# EAGLE design mp28164-buck-boost-flashlight-driver-tester-mk-1.1.0 (EAGLE 9.2.2)
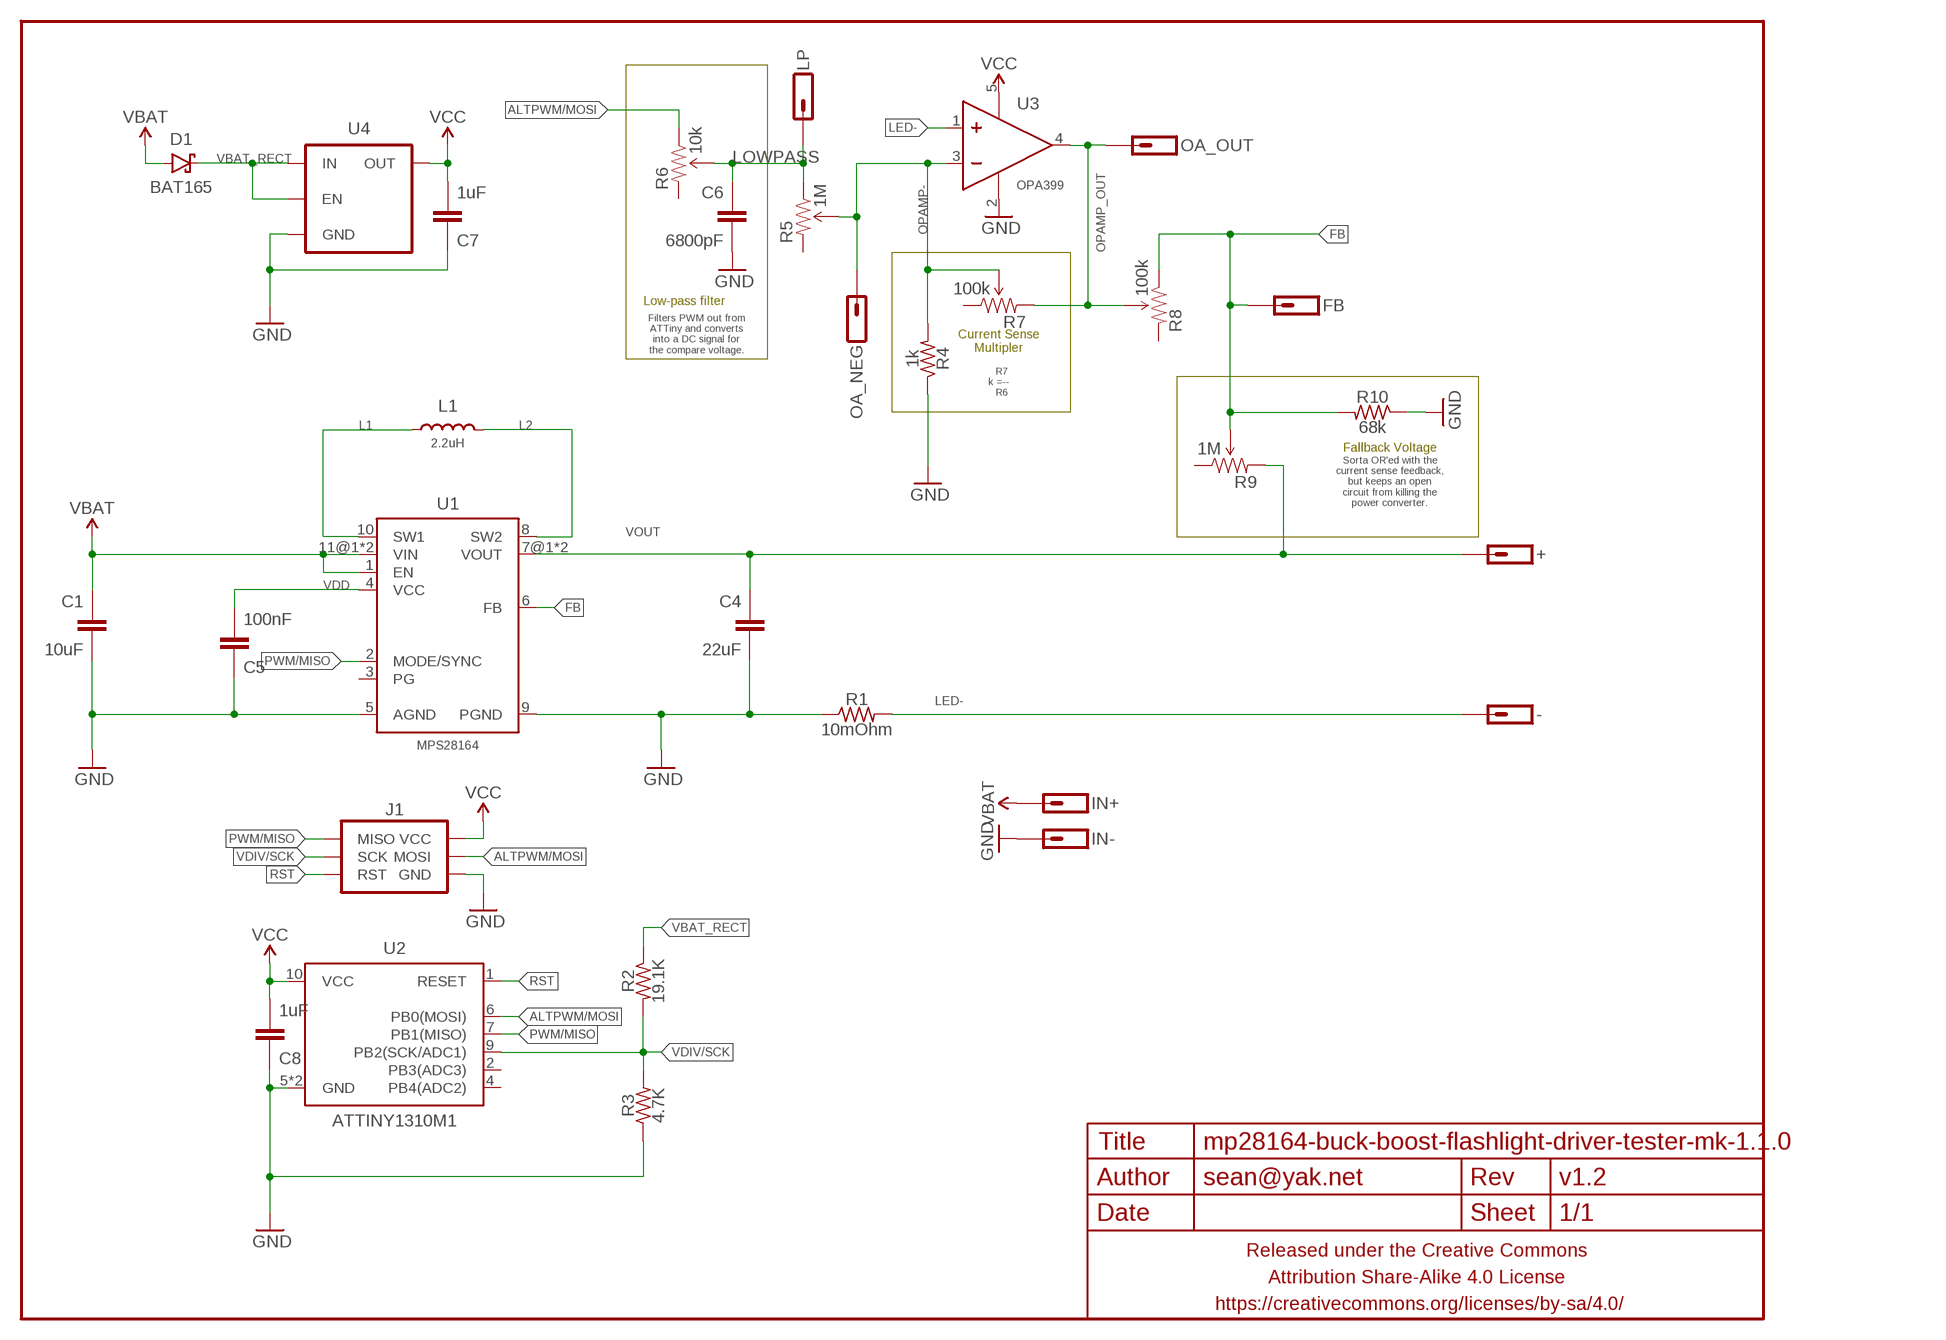
[diagram p0: schematic, sheet 1]

## Parts
+  M01PTH-1MM-CIR-NS  [1X01-1MM-CIR-NS]
-  M01PTH-1MM-CIR-NS  [1X01-1MM-CIR-NS]
C1  10uF  CAPACITOR-CERAMICC1206  [C1206]
C4  22uF  CAPACITOR-CERAMICC1206  [C1206]
C5  100nF  CAPACITOR-CERAMICC0402  [C0402]
C6  6800pF  CAPACITOR-CERAMICC0402  [C0402]
C7  1uF  CAPACITOR-CERAMICC0402  [C0402]
C8  1uF  CAPACITOR-CERAMICC0402  [C0402]
D1  BAT165  DIODE-SCHOTTKYSOD323  [SOD323-SCHOTTKY]
FB  M01SMD-1MM-DIA-NS  [1X01-SMD-1MM-DIA-NS]
FRAME1  FRAME-LETTERNO_PACKAGE  [DUMMY]
IN+  M01PTH-1MM-CIR-NS  [1X01-1MM-CIR-NS]
IN-  M01PTH-1MM-CIR-NS  [1X01-1MM-CIR-NS]
J1  AVR_SPI_PRG_6PTH  [2X3]
L1  2.2uH  INDUCTORXAL7070  [XAL7070]
LP  M01SMD-1MM-DIA-NS  [1X01-SMD-1MM-DIA-NS]
OA_NEG  M01SMD-1MM-DIA-NS  [1X01-SMD-1MM-DIA-NS]
OA_OUT  M01SMD-1MM-DIA-NS  [1X01-SMD-1MM-DIA-NS]
R1  10mOhm  RESISTORR1206  [R1206]
R2  19.1K  RESISTORR0402  [R0402]
R3  4.7K  RESISTORR0402  [R0402]
R4  1k  RESISTORR0402  [R0402]
R5  1M  TRIMPOTEVM3Y-LESS  [EVM3Y-LESS]
R6  10k  TRIMPOTEVM3Y-LESS  [EVM3Y-LESS]
R7  100k  TRIMPOTEVM3Y-LESS  [EVM3Y-LESS]
R8  100k  TRIMPOTEVM3Y-LESS  [EVM3Y-LESS]
R9  1M  TRIMPOTEVM3Y-LESS  [EVM3Y-LESS]
R10  68k  RESISTORR0402  [R0402]
U1  MPS28164  [MPS28164]
U2  ATTINY1310M1  [QFN10(2X5)]
U3  OPA399  OPAMPOPA333-SC-70  [SC70]
U4  V_REG_ENTLV700  [SC70]

## Nets
ALTPWM/MOSI: J1.4(MOSI) R6.A(CCW) U2.6(PB0(MOSI))
FB: FB.P$1 R8.A(CCW) R9.S(WIPER) R10.2 U1.6(FB)
GND: C1.2 C4.2 C5.1 C6.2 C7.1 C8.1 IN-.1 J1.6(GND) R1.1 R3.1 R4.1 R10.1 U1.5(AGND) U1.9(PGND) U2.5(GND) U2.PAD(GND) U3.2(V-) U4.2(GND)
L1: L1.P$1 U1.10(SW1)
L2: L1.P$2 U1.8(SW2)
LED-: -.1 R1.2 U3.1(IN+)
LOWPASS: C6.1 LP.P$1 R5.A(CCW) R6.S(WIPER)
OPAMP-: OA_NEG.P$1 R4.2 R5.S(WIPER) R7.S(WIPER) U3.3(IN-)
OPAMP_OUT: OA_OUT.P$1 R7.E(CW) R8.S(WIPER) U3.4(OUT)
PWM/MISO: J1.1(MISO) U1.2(MODE/SYNC) U2.7(PB1(MISO))
RST: J1.5(RST) U2.1(RESET)
VBAT: C1.1 D1.A IN+.1 U1.1(EN) U1.11@1(VIN) U1.11@2(VIN)
VBAT_RECT: D1.C R2.1 U4.1(IN) U4.3(EN)
VCC: C7.2 C8.2 J1.2(VCC) U2.10(VCC) U3.5(V+) U4.5(OUT)
VDD: C5.2 U1.4(VCC)
VDIV/SCK: J1.3(SCK) R2.2 R3.2 U2.9(PB2(SCK/ADC1))
VOUT: +.1 C4.1 R9.E(CW) U1.7@1(VOUT) U1.7@2(VOUT)
Unconnected: R5.E(CW) R6.E(CW) R7.A(CCW) R8.E(CW) R9.A(CCW) U1.3(PG) U2.2(PB3(ADC3)) U2.4(PB4(ADC2))

## Notes on the sheet
- Low-pass filter
- Filters PWM out from
  ATTiny and converts
  into a DC signal for
  the compare voltage.
- Current Sense
  Multipler
- R7
  k =--
    R6
- Fallback Voltage
- Sorta OR'ed with the
  current sense feedback,
  but keeps an open
  circuit from killing the
  power converter.

## Library data of the parts
+ - FB IN+ IN- LP OA_NEG OA_OUT = a_parts:M01: Header 1 Standard 1-pin 0.1" header. Use with straight break away headers (SKU : PRT-00116), right angle break away headers (PRT-00553), swiss pins (PRT-00743), machine pins (PRT-00117), and female headers (PRT-00115).
C1 C4-C8 = a_parts:CAPACITOR-CERAMIC: CAPACITOR, European symbol
D1 = a_parts:DIODE-SCHOTTKY: Schottky diodes in SFE's production catalog BAT20J 1A 23V 0.62Vf RB751 120mA 40V 0.37Vf PMEG4005EJ 0.5A 40V 0.42Vf MBRA140 1A 40V 0.5Vf B340A 3A 40V SMA
FRAME1 = a_parts:FRAME-LETTER: Schematic Frame Standard 8.5x11 US Letter frame; DESIGNER: sean@yak.net; VERSION: v1.2
J1 = a_parts:AVR_SPI_PRG_6: AVR ISP 6 Pin This is the reduced ISP connector for AVR programming. Common on Arduino. This footprint will take up less PCB space and can be used with a 10-pin to 6-pin adapter such as SKU: BOB-08508 **Special note about "TEST_POINT" package. The stop mask is on the top side, so if you want your programming test points to be on the bottom of your board, make sure to place this package on the bottom side of the board. This also ensure that the orientation to program from the bottom side will be correct.
L1 = a_parts:INDUCTOR: Inductors Basic Inductor/Choke - 0603 and 1206. Footprints are not proven and vary greatly between part numbers. SRN6045- 33uH, 20% 1.4A SDR0403-560KL - 56uH, 10%, 500mA RMS/740mA peak
R1-R4 R10 = a_parts:RESISTOR: RESISTOR, American symbol
R5-R9 = a_parts:TRIMPOT: Various small potentiometers for "set-and-forget" applications
U1 = a_parts:MPS28164
U2 = a_parts:ATTINY13: Atmel 8-pin 1kB flash uC
U3 = a_parts:OPAMP
U4 = a_parts:V_REG_EN

## Board
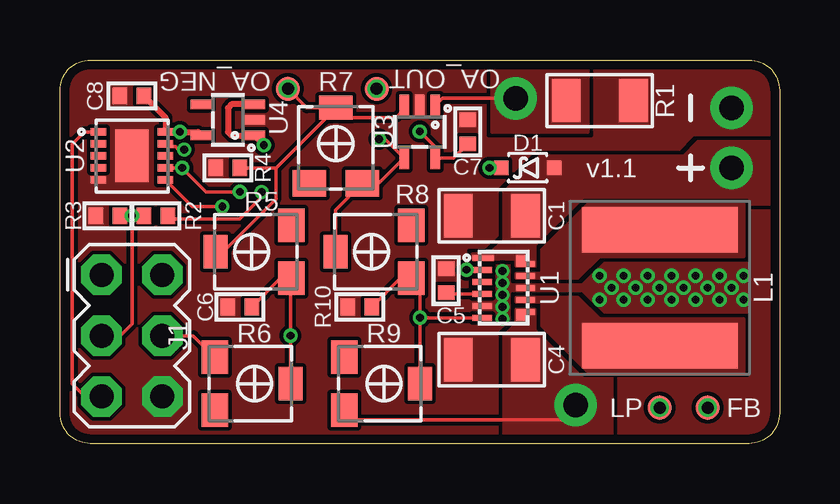
[diagram p1: board, top side]
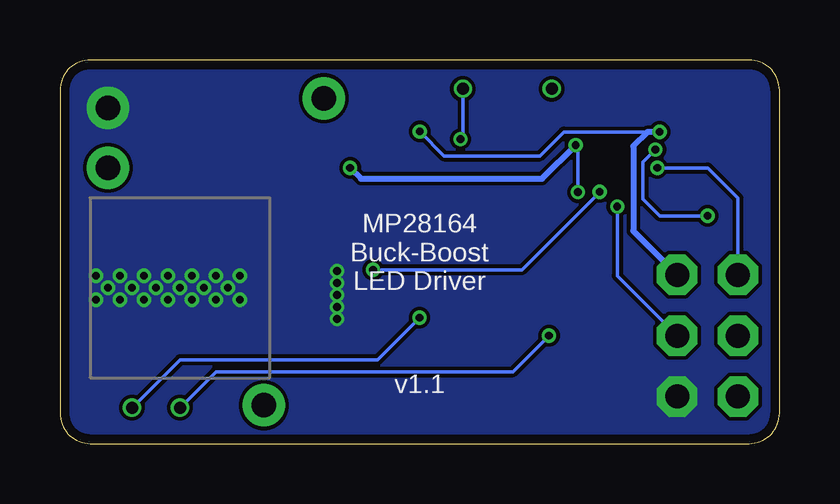
[diagram p2: board, bottom side, seen from below]

Size 30 x 16 mm. Coordinates in mm from the lower left corner, seen from the top.
Outline: 1.27,16 28.73,16 arc-90 30,14.73 30,1.27 arc-90 28.73,0 1.27,0 arc-90 0,1.27 0,14.73 arc-90 1.27,16
Copper layers (1*16): Top 0.035559375mm / dielectric 1.6mm / Bottom 0.035559375mm
Design rules "oshpark-2layer *": minimum track width 6mil, minimum drill 10mil, track to track 6mil, track to pad 6mil, pad to pad 6mil, via to via 6mil, smd to smd 0mil, copper to edge 15mil, drill to drill 6mil, minimum pad ring 5mil, minimum via ring 5mil, stop-mask expansion 2.5mil, vias tented up to drill 0.499mm, thermal gap 10mil

### Footprints (pad centres in the part's own frame; a part is rotated, then mirrored left to right if it is on the bottom)
1X01-1MM-CIR-NS = drill 1.016 pad 1.778: 1 0,0
C1206 = smd 1.2 x 1.8: 1 -1.4,0; 2 1.4,0
C0402 = smd 0.6 x 0.7: 1 -0.5,0; 2 0.5,0
SOD323-SCHOTTKY = smd 0.6 x 0.6: A -1.1,0; C 1.1,0
1X01-SMD-1MM-DIA-NS = smd 1 x 1: P$1 0,0
2X3 = drill 1 pad 1.676 octagon: 1 -2.54,-1.27; 2 -2.54,1.27; 3 0,-1.27; 4 0,1.27; 5 2.54,-1.27; 6 2.54,1.27
XAL7070 = smd 1.9 x 6.5: P$1 -2.41,0; P$2 2.41,0
R1206 = smd 1.2 x 1.8: 1 -1.4,0; 2 1.4,0
R0402 = smd 0.6 x 0.7: 1 -0.5,0; 2 0.5,0
EVM3Y-LESS = smd 1.4 x 1.1: A -1.1,-1.65; E 1.1,-1.65 | smd 1.4 x 1: S 0,1.5
MPS28164 = smd 0.9 x 0.25: 1 -0.85,1.25 | smd 0.8 x 0.25: 2 -0.9,0.75; 3 -0.9,0.25; 4 -0.9,-0.25; 5 -0.9,-0.75; 6 -0.9,-1.25; 7@1 0.9,-1; 8 0.9,-0.5; 9 0.9,0; 10 0.9,0.5; 11@1 0.9,1 | smd 0.4 x 0.25: 7@2 0.7,-1.25; 11@2 0.71,1.25
QFN10(2X5) = smd 0.65 x 0.3: 1 -1.4,1; 2 -1.4,0.5; 3 -1.4,0; 4 -1.4,-0.5; 5 -1.4,-1; 6 1.4,-1; 7 1.4,-0.5; 8 1.4,0; 9 1.4,0.5; 10 1.4,1 | smd 1.4 x 2.2: PAD 0,0
SC70 = smd 0.4 x 0.9: 1 -0.65,-1.1; 2 0,-1.1; 3 0.65,-1.1; 4 0.65,1.1; 5 -0.65,1.1

### Placement (x,y rotation side)
+  21.5,1.6 270 top
-  19,14.4 180 top
C1  18,9.5 180 top
C4  18,3.5 180 top
C5  16.1,6.8 270 top
C6  7.5,5.7 180 top
C7  17,13 270 top
C8  3,14.5 0 top
D1  19.5,11.5 180 top
FB  27,1.5 0 top
FRAME1  0,0 270 top
IN+  28,11.5 0 top
IN-  28,14 270 top
J1  3,4.5 270 top
L1  25,6.5 270 top
LP  25,1.5 0 top
OA_NEG  9.5,14.8 0 top
OA_OUT  13.2,14.8 0 top
R1  22.5,14.3 180 top
R2  4,9.5 180 top
R3  2,9.5 0 top
R4  7,11.5 0 top
R5  7.99,8 90 top
R6  8.11,2.5 270 top
R7  11.5,12.51 0 top
R8  12.99,8 90 top
R9  13.51,2.5 270 top
R10  12.5,5.7 0 top
U1  18.5,6.5 0 top
U2  3,12 0 top
U3  15,13 180 top
U4  7,13.5 90 top

### Tracks (layer width: path | path; a pad name or v marks a point on that pad's centre or on a via)
ALTPWM/MOSI  (via drill 0.33)
  Top 0.152: U2.6 5.51,9.89 v6.77,9.89 | J1.4 5.56,4.5 R6.A
  Bottom 0.152: v6.77,9.89 6.77,7 J1.4
FB  (via drill 0.33, 0.5)
  Top 0.152: U1.6 v15.01,5.25 | R10.2 14.2,6.9 R8.A 15.01,6.53 v15.01,5.25 | R9.S v15.01,5.25
  Bottom 0.152: v15.01,5.25 16.76,3.5 25,3.5 FB.P$1
  other vias: 27,1.5
GND  (via drill 0.33)
  other vias: 23,6.5 24,6.5 25,6.5 26,6.5 27,6.5 28,6.5 28.5,7 28.5,6 27.5,6 27.5,7 26.5,7 25.5,7 24.5,7 23.5,7 22.5,7 22.5,6 23.5,6 24.5,6 25.5,6 26.5,6 18.45,7.2 18.45,6.7 18.45,6.2 18.45,5.7 18.45,5.2
  pour Top (rank 6, no thermals): 0,16 0,0 30,0 30,16
  pour Bottom (rank 6, no thermals): 0,0 0,16 30,16 30,0
L1
  pour Top (rank 2, no thermals): 19,7.1 19,6.9 21.6,6.9 22.5,7.8 28.5,7.8 28.5,10 22,10 20.1,8.1 20.1,7.1
L2
  pour Top (rank 2, no thermals): 19,6.1 19,5.9 20.1,5.9 20.1,4.9 22,3 28.5,3 28.5,5.2 22.5,5.2 21.6,6.1
LED-
  Top 0.152: U3.1 15.95,14.4 -.1
  pour Top (rank 2, no thermals): 18,16 18,13 22,13 22,16
LOWPASS  (via drill 0.33, 0.5)
  Top 0.152: C6.1 9.2,6.9 R5.A 9.61,6.87 v9.61,4.5 R6.S
  Bottom 0.152: LP.P$1 23.5,3 11.11,3 v9.61,4.5
  other vias: 25,1.5
OPAMP-  (via drill 0.5)
  Top 0.152: R5.S 6.8,8 9,10.2 9,11.5 | 9,11.5 R4.2 | R7.S 10.29,14.01 OA_NEG.P$1 | R7.S 9,11.5 | U3.3 14.35,13.95 14,13.6 11.9,13.6 R7.S
  other vias: 9.5,14.8
OPAMP_OUT  (via drill 0.33, 0.5)
  Top 0.152: R8.S 11.49,9.75 R7.E 13.31,10.86 U3.4 13.55,12.7 v13.3,12.7
  Bottom 0.152: OA_OUT.P$1 13.2,12.8 v13.3,12.7
  other vias: 13.2,14.8
PWM/MISO  (via drill 0.33)
  Top 0.152: U2.7 v5.1,11.5 6.1,10.5 v7.5,10.5 | v16.95,7.25 U1.2
  Bottom 0.152: v5.1,11.5 3,11.5 1.73,10.23 J1.1 | v7.5,10.5 10.75,7.25 v16.95,7.25
RST
  Top 0.152: U2.1 1,13 0.5,12.5 0.5,2.5 1.04,1.96 J1.5
VBAT
  pour Top (rank 3, no thermals): 17.2,7.9 17.2,7.7 19,7.7 19,7.4 19.9,7.4 20.5,8 20.5,8.5 22,10 30,10 30,12.6 26.6,12.6 26,12 20,12 18.5,10.5 18.5,8.5 17.9,7.9
VBAT_RECT  (via drill 0.33)
  Top 0.152: v8.4,10.48 8.4,10.28 7.49,9.37 4.63,9.37 R2.1
  Top 0.25: v8.5,12.45 U4.1 7.15,12.85 7,13 7,14 7.15,14.15 U4.3 | D1.C v17.9,11.5
  Bottom 0.152: v8.5,12.45 8.4,12.35 v8.4,10.48
  Bottom 0.25: v17.9,11.5 17.45,11.05 9.9,11.05 v8.5,12.45
VCC  (via drill 0.33)
  Top 0.152: v15,13.02 15.65,12.37 U3.5 16.4,11.9 C7.2
  Top 0.25: C8.2 4.4,13.6 U2.10 v5,13 5.75,13 U4.5
  Bottom 0.152: v15,13.02 14,12 10,12 9,13 5.04,13 5.02,13.02 v5,13
  Bottom 0.25: v5,13 5.5,13 6.1,12.4 6.1,8.87 J1.2
VDD
  Top 0.152: U1.4 16.15,6.25 C5.2
VDIV/SCK  (via drill 0.33)
  Top 0.152: J1.3 2.5,4.5 3,5 v3,9.5 | R3.2 v3,9.5 | v3,9.5 R2.2 | U2.9 4.52,12.38 4.82,12.38 4.93,12.26 v5.17,12.26
  Bottom 0.152: v5.17,12.26 5.7,11.73 5.7,10.2 5,9.5 v3,9.5
VOUT
  Top 0.152: 21.3,1.4 +.1 20.9,1 12.26,1 R9.E
  pour Top (rank 4, no thermals): 18.5,4.5 18.5,0 23,0 23,3 22,3 19.8,5.2 19.8,5.6 19,5.6 19,5

### Text on the board
bPlace: MP28164 / Buck-Boost / LED Driver